# EAGLE design bb-7 (EAGLE 7.5.0)
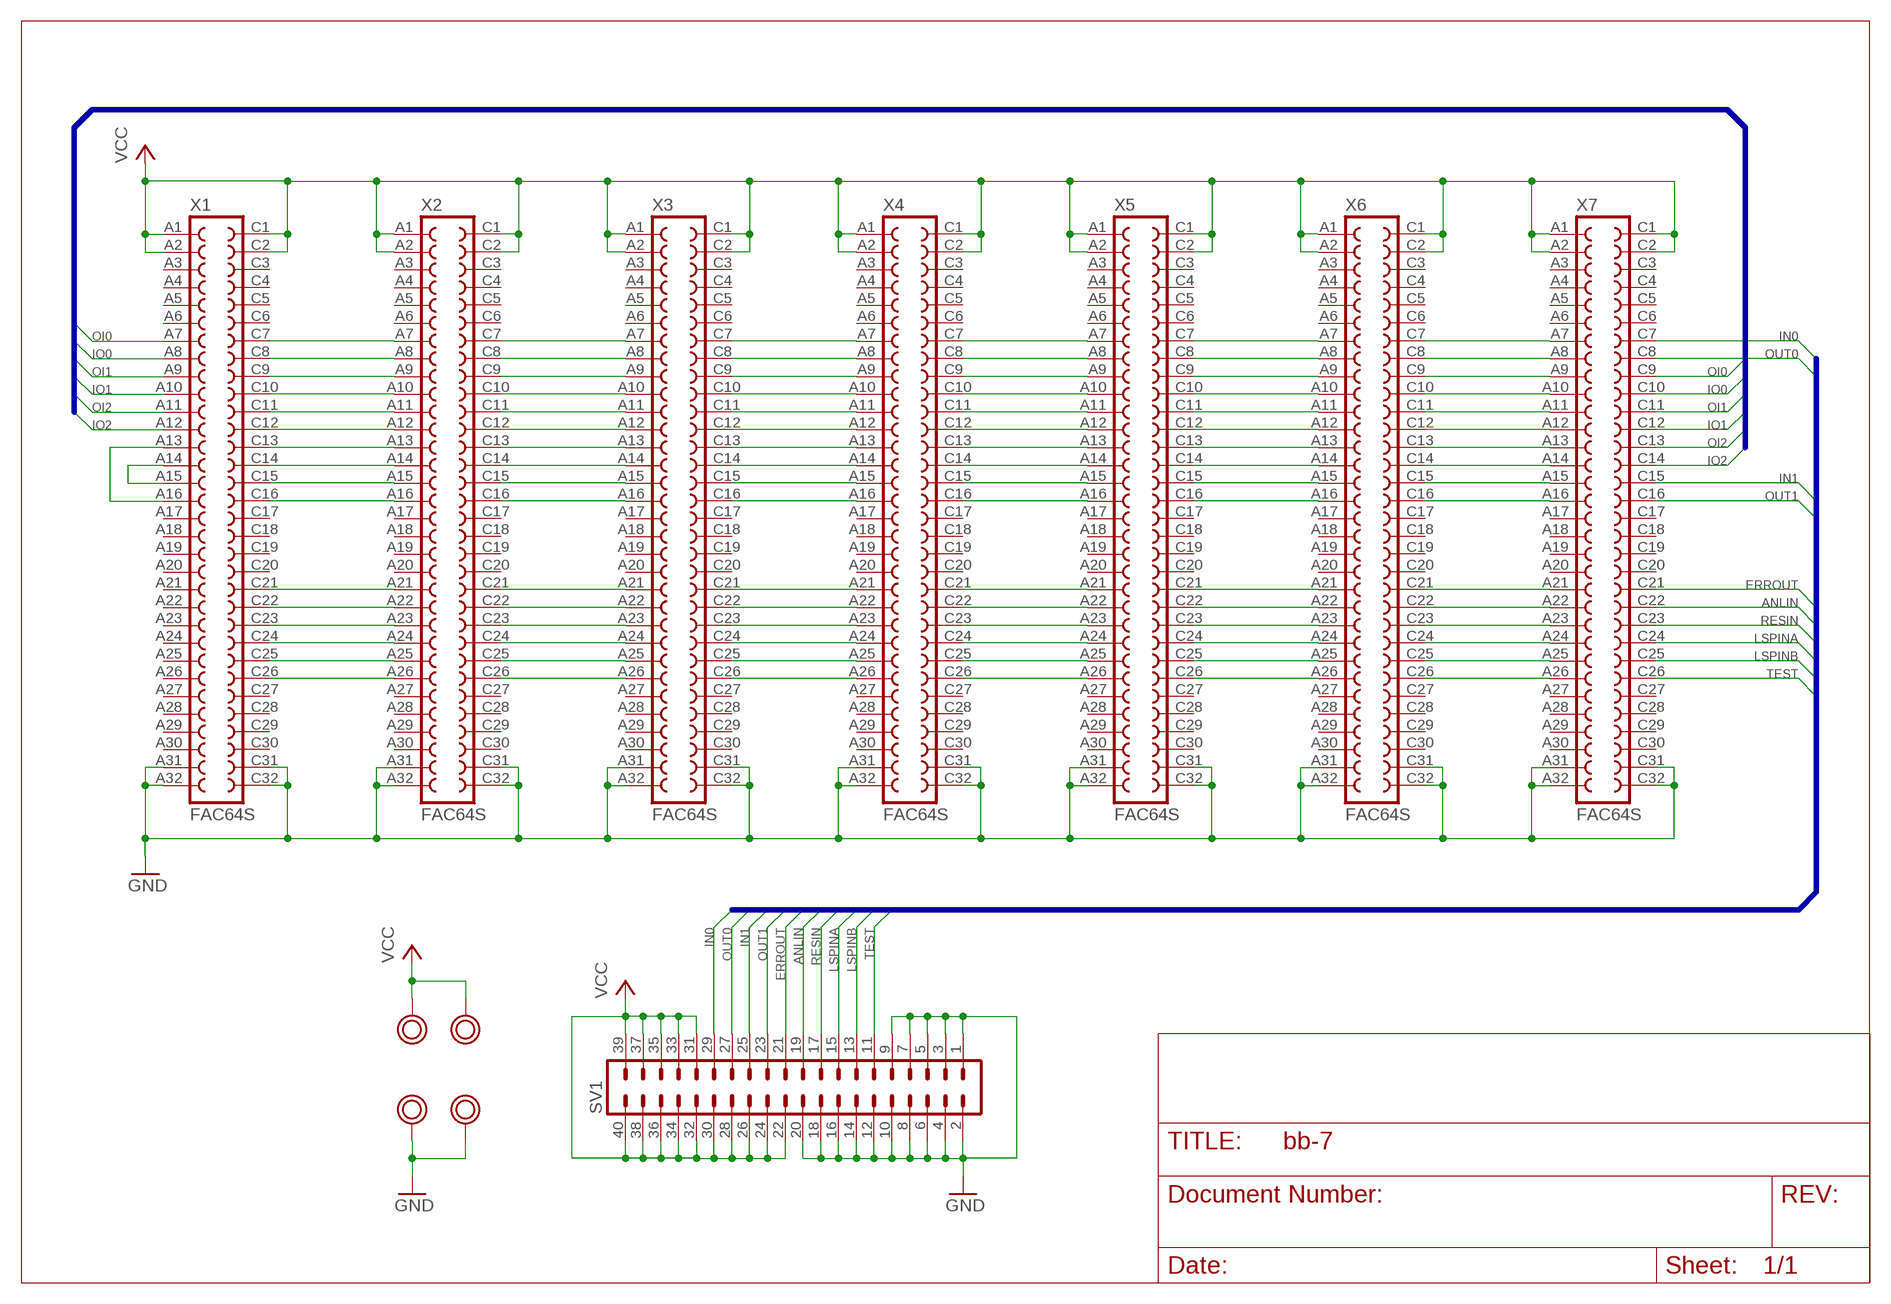
[diagram p0: schematic, sheet 1]

## Parts
SV1  MA20-2  [MA20-2]
U$3  POWERPAD  [POWERPAD]
U$4  POWERPAD  [POWERPAD]
U$5  POWERPAD  [POWERPAD]
U$6  POWERPAD  [POWERPAD]
X1  FAC64S  [FAC64S]
X2  FAC64S  [FAC64S]
X3  FAC64S  [FAC64S]
X4  FAC64S  [FAC64S]
X5  FAC64S  [FAC64S]
X6  FAC64S  [FAC64S]
X7  FAC64S  [FAC64S]

## Nets
ANLIN: SV1.19 X7.C22
ERROUT: SV1.21 X7.C21
GND: SV1.1 SV1.2 SV1.3 SV1.4 SV1.5 SV1.6 SV1.7 SV1.8 SV1.9 SV1.10 SV1.12 SV1.14 SV1.16 SV1.18 SV1.20 U$3.P$1 U$4.P$1 X1.A31 X1.A32 X1.C31 X1.C32 X2.A31 X2.A32 X2.C31 X2.C32 X3.A31 X3.A32 X3.C31 X3.C32 X4.A31 X4.A32 X4.C31 X4.C32 X5.A31 X5.A32 X5.C31 X5.C32 X6.A31 X6.A32 X6.C31 X6.C32 X7.A31 X7.A32 X7.C31 X7.C32
IN0: SV1.29 X7.C7
IN1: SV1.25 X7.C15
IO0: X1.A8 X7.C10
IO1: X1.A10 X7.C12
IO2: X1.A12 X7.C14
LSPINA: SV1.15 X7.C24
LSPINB: SV1.13 X7.C25
N$1: X1.A13 X1.A16
N$2: X1.A14 X1.A15
N$3: X4.C7 X5.A7
N$4: X2.C7 X3.A7
N$5: X2.C8 X3.A8
N$6: X2.C9 X3.A9
N$7: X1.C7 X2.A7
N$8: X1.C8 X2.A8
N$9: X1.C9 X2.A9
N$10: X1.C10 X2.A10
N$11: X1.C11 X2.A11
N$12: X1.C12 X2.A12
N$13: X1.C13 X2.A13
N$14: X1.C14 X2.A14
N$15: X1.C15 X2.A15
N$16: X1.C16 X2.A16
N$17: X2.C10 X3.A10
N$18: X2.C11 X3.A11
N$19: X2.C12 X3.A12
N$20: X2.C13 X3.A13
N$21: X1.C21 X2.A21
N$22: X1.C22 X2.A22
N$23: X1.C23 X2.A23
N$24: X1.C24 X2.A24
N$25: X1.C25 X2.A25
N$26: X1.C26 X2.A26
N$27: X2.C14 X3.A14
N$28: X2.C15 X3.A15
N$29: X2.C16 X3.A16
N$30: X2.C21 X3.A21
N$32: X2.C22 X3.A22
N$33: X2.C23 X3.A23
N$34: X2.C24 X3.A24
N$35: X2.C25 X3.A25
N$36: X2.C26 X3.A26
N$37: X4.C8 X5.A8
N$38: X4.C9 X5.A9
N$39: X3.C7 X4.A7
N$40: X3.C8 X4.A8
N$41: X3.C9 X4.A9
N$42: X3.C10 X4.A10
N$43: X3.C11 X4.A11
N$44: X3.C12 X4.A12
N$45: X3.C13 X4.A13
N$46: X3.C14 X4.A14
N$47: X3.C15 X4.A15
N$48: X3.C16 X4.A16
N$49: X3.C21 X4.A21
N$50: X3.C22 X4.A22
N$51: X3.C23 X4.A23
N$52: X3.C24 X4.A24
N$53: X3.C25 X4.A25
N$54: X3.C26 X4.A26
N$55: X4.C10 X5.A10
N$56: X4.C11 X5.A11
N$57: X4.C12 X5.A12
N$58: X4.C13 X5.A13
N$59: X4.C14 X5.A14
N$60: X4.C15 X5.A15
N$61: X4.C16 X5.A16
N$62: X4.C21 X5.A21
N$63: X4.C22 X5.A22
N$64: X4.C23 X5.A23
N$65: X4.C24 X5.A24
N$66: X4.C25 X5.A25
N$67: X4.C26 X5.A26
N$69: X5.C7 X6.A7
N$70: X5.C8 X6.A8
N$71: X5.C9 X6.A9
N$72: X5.C10 X6.A10
N$73: X5.C11 X6.A11
N$74: X5.C12 X6.A12
N$75: X5.C13 X6.A13
N$76: X5.C14 X6.A14
N$77: X5.C15 X6.A15
N$78: X5.C16 X6.A16
N$79: X5.C21 X6.A21
N$80: X5.C22 X6.A22
N$81: X5.C23 X6.A23
N$82: X5.C24 X6.A24
N$83: X5.C25 X6.A25
N$84: X5.C26 X6.A26
N$85: X6.C7 X7.A7
N$86: X6.C8 X7.A8
N$87: X6.C9 X7.A9
N$88: X6.C10 X7.A10
N$89: X6.C11 X7.A11
N$90: X6.C12 X7.A12
N$91: X6.C13 X7.A13
N$92: X6.C14 X7.A14
N$93: X6.C15 X7.A15
N$94: X6.C16 X7.A16
N$95: X6.C21 X7.A21
N$96: X6.C22 X7.A22
N$97: X6.C23 X7.A23
N$98: X6.C24 X7.A24
N$99: X6.C25 X7.A25
N$100: X6.C26 X7.A26
OI0: X1.A7 X7.C9
OI1: X1.A9 X7.C11
OI2: X1.A11 X7.C13
OUT0: SV1.27 X7.C8
OUT1: SV1.23 X7.C16
RESIN: SV1.17 X7.C23
TEST: SV1.11 X7.C26
VCC: SV1.22 SV1.24 SV1.26 SV1.28 SV1.30 SV1.31 SV1.32 SV1.33 SV1.34 SV1.35 SV1.36 SV1.37 SV1.38 SV1.39 SV1.40 U$5.P$1 U$6.P$1 X1.A1 X1.A2 X1.C1 X1.C2 X2.A1 X2.A2 X2.C1 X2.C2 X3.A1 X3.A2 X3.C1 X3.C2 X4.A1 X4.A2 X4.C1 X4.C2 X5.A1 X5.A2 X5.C1 X5.C2 X6.A1 X6.A2 X6.C1 X6.C2 X7.A1 X7.A2 X7.C1 X7.C2
Unconnected: X1.A3 X1.A4 X1.A5 X1.A6 X1.A17 X1.A18 X1.A19 X1.A20 X1.A21 X1.A22 X1.A23 X1.A24 X1.A25 X1.A26 X1.A27 X1.A28 X1.A29 X1.A30 X1.C3 X1.C4 X1.C5 X1.C6 X1.C17 X1.C18 X1.C19 X1.C20 X1.C27 X1.C28 X1.C29 X1.C30 X2.A3 X2.A4 X2.A5 X2.A6 X2.A17 X2.A18 X2.A19 X2.A20 X2.A27 X2.A28 X2.A29 X2.A30 X2.C3 X2.C4 X2.C5 X2.C6 X2.C17 X2.C18 X2.C19 X2.C20 X2.C27 X2.C28 X2.C29 X2.C30 X3.A3 X3.A4 X3.A5 X3.A6 X3.A17 X3.A18 X3.A19 X3.A20 X3.A27 X3.A28 X3.A29 X3.A30 X3.C3 X3.C4 X3.C5 X3.C6 X3.C17 X3.C18 X3.C19 X3.C20 X3.C27 X3.C28 X3.C29 X3.C30 X4.A3 X4.A4 X4.A5 X4.A6 X4.A17 X4.A18 X4.A19 X4.A20 X4.A27 X4.A28 X4.A29 X4.A30 X4.C3 X4.C4 X4.C5 X4.C6 X4.C17 X4.C18 X4.C19 X4.C20 X4.C27 X4.C28 X4.C29 X4.C30 X5.A3 X5.A4 X5.A5 X5.A6 X5.A17 X5.A18 X5.A19 X5.A20 X5.A27 X5.A28 X5.A29 X5.A30 X5.C3 X5.C4 X5.C5 X5.C6 X5.C17 X5.C18 X5.C19 X5.C20 X5.C27 X5.C28 X5.C29 X5.C30 X6.A3 X6.A4 X6.A5 X6.A6 X6.A17 X6.A18 X6.A19 X6.A20 X6.A27 X6.A28 X6.A29 X6.A30 X6.C3 X6.C4 X6.C5 X6.C6 X6.C17 X6.C18 X6.C19 X6.C20 X6.C27 X6.C28 X6.C29 X6.C30 X7.A3 X7.A4 X7.A5 X7.A6 X7.A17 X7.A18 X7.A19 X7.A20 X7.A27 X7.A28 X7.A29 X7.A30 X7.C3 X7.C4 X7.C5 X7.C6 X7.C17 X7.C18 X7.C19 X7.C20 X7.C27 X7.C28 X7.C29 X7.C30

## Buses
IN[0..1],OUT[0..1],ERRIN,ERROUT,ANLIN,RESIN,LSPINA,LSPINB,TEST
IO[0..2],OI[0..2]

## Library data of the parts
SV1 = con-lstb:MA20-2: PIN HEADER; OC_FARNELL: unknown; OC_NEWARK: unknown
U$3-U$6 = Transputer:POWERPAD
X1-X7 = con-vg:FAC64S: CONNECTOR female, 64 pins, block, type C, rows AC, grid 5.08 mm

## Board
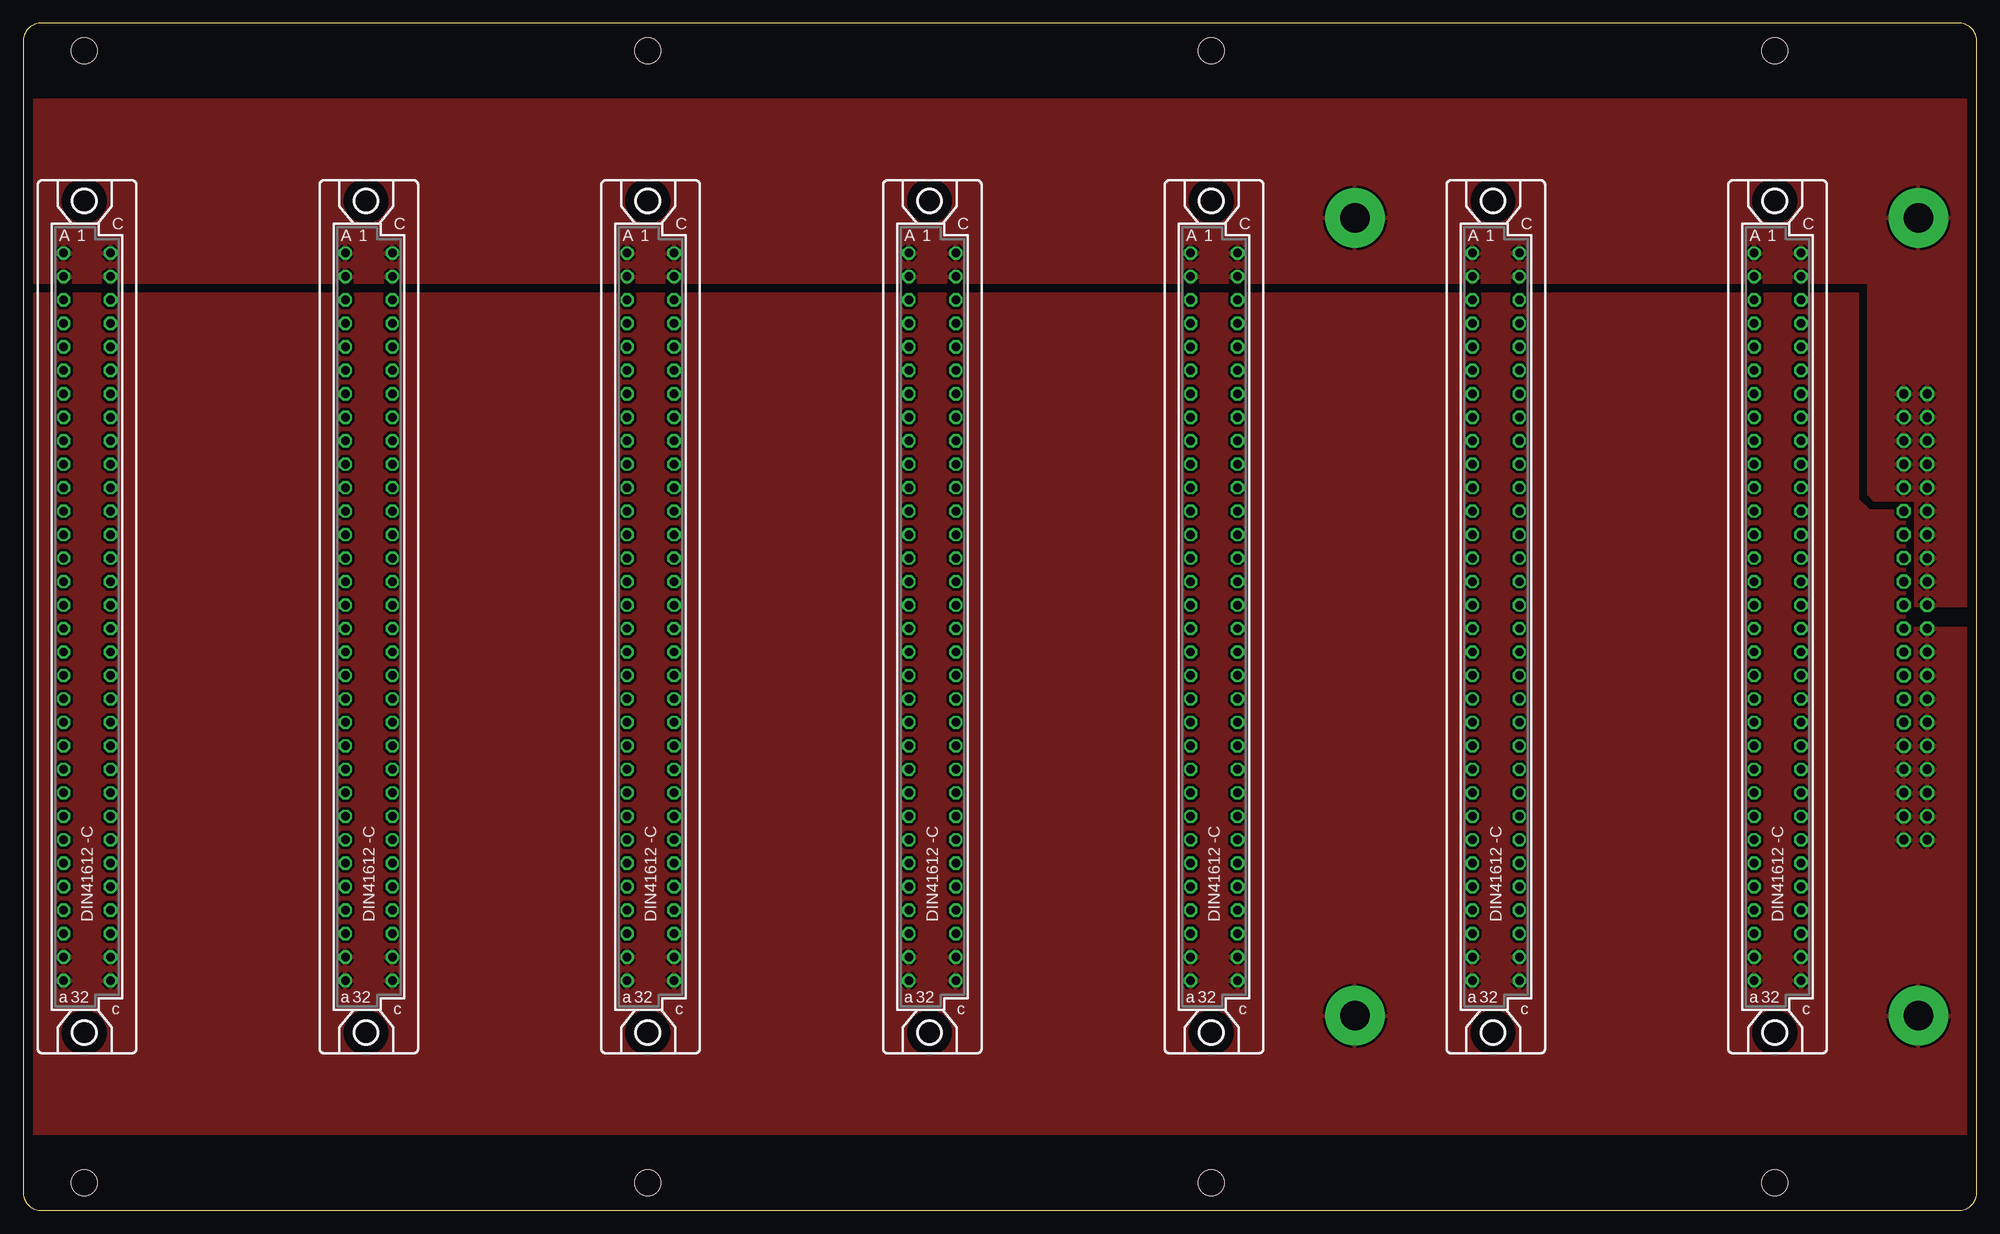
[diagram p1: board, top side]
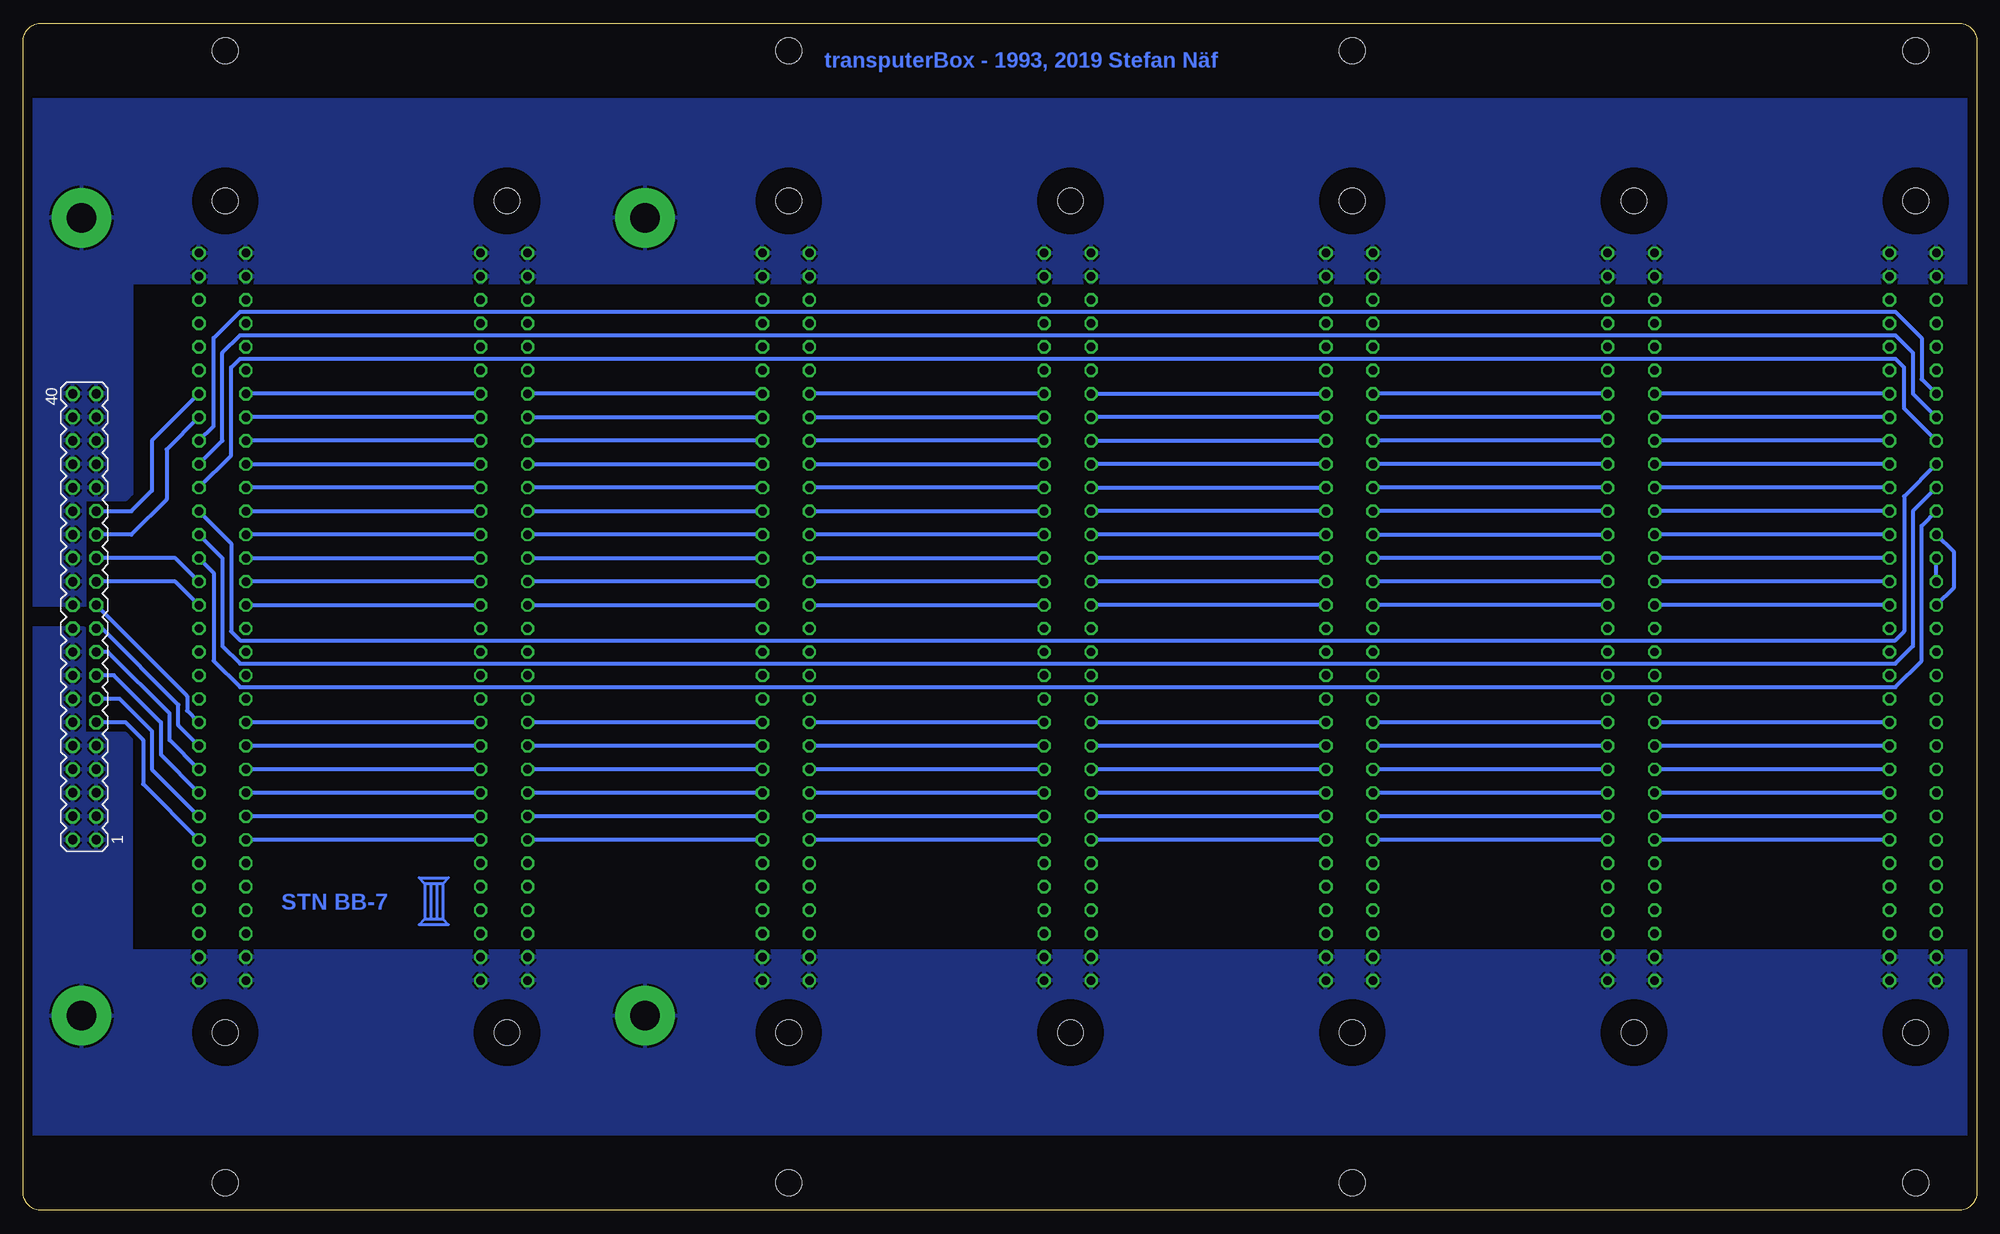
[diagram p2: board, bottom side, seen from below]

Size 211.36 x 128.5 mm. Coordinates in mm from the lower left corner, seen from the top.
Outline: 0,126.5 0,2 arc90 2,0 209.36,0 arc90 211.36,2 211.36,126.5 arc90 209.36,128.5 2,128.5 arc90 0,126.5
Copper layers (1*16): Top 0.035mm / dielectric 1.5mm / Bottom 0.035mm
Design rules "default": minimum track width 10mil, minimum drill 24mil, track to track 8mil, track to pad 8mil, pad to pad 8mil, via to via 8mil, smd to smd 8mil, copper to edge 40mil, drill to drill 8mil, minimum pad ring 10mil, minimum via ring 8mil, stop-mask expansion 4mil, vias tented up to drill 0mil, thermal gap 10mil
Holes 2.8 mm at 6.62,3 67.58,3 128.54,3 189.5,3 189.5,125.5 128.54,125.5 67.58,125.5 6.62,125.5

### Footprints (pad centres in the part's own frame; a part is rotated, then mirrored left to right if it is on the bottom)
MA20-2 = drill 1.016 octagon: 1 -24.13,-1.27; 2 -24.13,1.27; 3 -21.59,-1.27; 4 -21.59,1.27; 5 -19.05,-1.27; 6 -19.05,1.27; 7 -16.51,-1.27; 8 -16.51,1.27; 9 -13.97,-1.27; 10 -13.97,1.27; 11 -11.43,-1.27; 12 -11.43,1.27; 13 -8.89,-1.27; 14 -8.89,1.27; 15 -6.35,-1.27; 16 -6.35,1.27; 17 -3.81,-1.27; 18 -3.81,1.27; 19 -1.27,-1.27; 20 -1.27,1.27; 21 1.27,-1.27; 22 1.27,1.27; 23 3.81,-1.27; 24 3.81,1.27; 25 6.35,-1.27; 26 6.35,1.27; 27 8.89,-1.27; 28 8.89,1.27; 29 11.43,-1.27; 30 11.43,1.27; 31 13.97,-1.27; 32 13.97,1.27; 33 16.51,-1.27; 34 16.51,1.27; 35 19.05,-1.27; 36 19.05,1.27; 37 21.59,-1.27; 38 21.59,1.27; 39 24.13,-1.27; 40 24.13,1.27
POWERPAD = drill 3.2 pad 6.452: P$1 0,0
FAC64S = drill 0.914 octagon: A1 -2.54,39.37; A2 -2.54,36.83; A3 -2.54,34.29; A4 -2.54,31.75; A5 -2.54,29.21; A6 -2.54,26.67; A7 -2.54,24.13; A8 -2.54,21.59; A9 -2.54,19.05; A10 -2.54,16.51; A11 -2.54,13.97; A12 -2.54,11.43; A13 -2.54,8.89; A14 -2.54,6.35; A15 -2.54,3.81; A16 -2.54,1.27; A17 -2.54,-1.27; A18 -2.54,-3.81; A19 -2.54,-6.35; A20 -2.54,-8.89; A21 -2.54,-11.43; A22 -2.54,-13.97; A23 -2.54,-16.51; A24 -2.54,-19.05; A25 -2.54,-21.59; A26 -2.54,-24.13; A27 -2.54,-26.67; A28 -2.54,-29.21; A29 -2.54,-31.75; A30 -2.54,-34.29; A31 -2.54,-36.83; A32 -2.54,-39.37; C1 2.54,39.37; C2 2.54,36.83; C3 2.54,34.29; C4 2.54,31.75; C5 2.54,29.21; C6 2.54,26.67; C7 2.54,24.13; C8 2.54,21.59; C9 2.54,19.05; C10 2.54,16.51; C11 2.54,13.97; C12 2.54,11.43; C13 2.54,8.89; C14 2.54,6.35; C15 2.54,3.81; C16 2.54,1.27; C17 2.54,-1.27; C18 2.54,-3.81; C19 2.54,-6.35; C20 2.54,-8.89; C21 2.54,-11.43; C22 2.54,-13.97; C23 2.54,-16.51; C24 2.54,-19.05; C25 2.54,-21.59; C26 2.54,-24.13; C27 2.54,-26.67; C28 2.54,-29.21; C29 2.54,-31.75; C30 2.54,-34.29; C31 2.54,-36.83; C32 2.54,-39.37 | hole 2.794: -0.305,45.009; -0.305,-45.009

### Placement (x,y rotation side)
SV1  204.72,64.25 90 bottom
U$1  [LOGO]  166.94,33.45 0 bottom
U$3  205.04,21.07 0 top
U$4  144.08,21.07 0 top
U$5  205.04,107.43 0 top
U$6  144.08,107.43 0 top
X1  6.92,64.25 0 top
X2  37.4,64.25 0 top
X3  67.88,64.25 0 top
X4  98.36,64.25 0 top
X5  128.84,64.25 0 top
X6  159.32,64.25 0 top
X7  189.8,64.25 0 top

### Tracks (layer width: path | path; a pad name or v marks a point on that pad's centre or on a via)
ANLIN
  Bottom 0.406: X7.C22 194.56,52.5 194.56,54.73 202.82,62.98 SV1.19
ERROUT
  Bottom 0.406: X7.C21 193.61,54.09 193.61,55.68 SV1.21
GND
  pour Top (isolate 0.305): -0.07,99.17 198.37,99.17 198.37,76.95 199.64,75.68 203.45,75.68 203.45,62.98 211.07,62.98 211.07,62.66 211.39,8.37 -0.07,8.37
  pour Bottom (isolate 0.406): -0.07,8.37 -0.07,28.05 211.39,28.05 211.39,8.37
  pour Bottom: 211.39,28.05 199.64,28.05 199.64,50.91 200.28,51.55 204.72,51.55 204.72,62.98 211.39,62.98
IN0
  Bottom 0.406: X7.C7 197.42,83.3 197.42,77.9 199.64,75.68 SV1.29
IN1
  Bottom 0.406: X7.C15 194.88,70.6 SV1.25
IO0
  Bottom 0.406: X7.C10 189.8,83.3 189.8,92.83 187.89,94.73 8.82,94.73 6.92,92.83 6.92,88.38 X1.A8
IO1
  Bottom 0.406: X7.C12 188.85,72.19 188.85,62.66 187.89,61.71 8.82,61.71 7.87,62.66 7.87,77.27 X1.A10
IO2
  Bottom 0.406: X7.C14 190.75,69.01 190.75,59.49 187.89,56.63 8.82,56.63 5.97,59.49 5.97,74.09 X1.A12
LSPINA
  Bottom 0.406: X7.C24 196.47,49.33 196.47,52.82 201.55,57.9 SV1.15
LSPINB
  Bottom 0.406: X7.C25 197.42,47.74 197.42,51.87 200.91,55.36 SV1.13
N$1
  Bottom 0.406: X1.A16 2.47,67.42 2.47,71.23 X1.A13
N$2
  Bottom 0.406: X1.A15 X1.A14
N$3
  Bottom 0.406: X4.C7 X5.A7
N$4
  Bottom 0.406: X2.C7 X3.A7
N$5
  Bottom 0.406: X2.C8 X3.A8
N$6
  Bottom 0.406: X2.C9 X3.A9
N$7
  Bottom 0.406: X1.C7 X2.A7
N$8
  Bottom 0.406: X1.C8 X2.A8
N$9
  Bottom 0.406: X1.C9 X2.A9
N$10
  Bottom 0.406: X1.C10 X2.A10
N$11
  Bottom 0.406: X1.C11 X2.A11
N$12
  Bottom 0.406: X1.C12 X2.A12
N$13
  Bottom 0.406: X1.C13 X2.A13
N$14
  Bottom 0.406: X1.C14 X2.A14
N$15
  Bottom 0.406: X1.C15 X2.A15
N$16
  Bottom 0.406: X1.C16 X2.A16
N$17
  Bottom 0.406: X2.C10 X3.A10
N$18
  Bottom 0.406: X2.C11 X3.A11
N$19
  Bottom 0.406: X2.C12 X3.A12
N$20
  Bottom 0.406: X3.A13 X2.C13
N$21
  Bottom 0.406: X1.C21 X2.A21
N$22
  Bottom 0.406: X1.C22 X2.A22
N$23
  Bottom 0.406: X1.C23 X2.A23
N$24
  Bottom 0.406: X1.C24 X2.A24
N$25
  Bottom 0.406: X1.C25 X2.A25
N$26
  Bottom 0.406: X1.C26 X2.A26
N$27
  Bottom 0.406: X2.C14 X3.A14
N$28
  Bottom 0.406: X2.C15 X3.A15
N$29
  Bottom 0.406: X2.C16 X3.A16
N$30
  Bottom 0.406: X2.C21 X3.A21
N$32
  Bottom 0.406: X2.C22 X3.A22
N$33
  Bottom 0.406: X2.C23 X3.A23
N$34
  Bottom 0.406: X2.C24 X3.A24
N$35
  Bottom 0.406: X2.C25 X3.A25
N$36
  Bottom 0.406: X2.C26 X3.A26
N$37
  Bottom 0.406: X5.A8 X4.C8
N$38
  Bottom 0.406: X4.C9 X5.A9
N$39
  Bottom 0.406: X4.A7 X3.C7
N$40
  Bottom 0.406: X3.C8 X4.A8
N$41
  Bottom 0.406: X4.A9 X3.C9
N$42
  Bottom 0.406: X3.C10 X4.A10
N$43
  Bottom 0.406: X4.A11 X3.C11
N$44
  Bottom 0.406: X3.C12 X4.A12
N$45
  Bottom 0.406: X3.C13 X4.A13
N$46
  Bottom 0.406: X3.C14 X4.A14
N$47
  Bottom 0.406: X3.C15 X4.A15
N$48
  Bottom 0.406: X3.C16 X4.A16
N$49
  Bottom 0.406: X3.C21 X4.A21
N$50
  Bottom 0.406: X3.C22 X4.A22
N$51
  Bottom 0.406: X3.C23 X4.A23
N$52
  Bottom 0.406: X3.C24 X4.A24
N$53
  Bottom 0.406: X3.C25 X4.A25
N$54
  Bottom 0.406: X3.C26 X4.A26
N$55
  Bottom 0.406: X5.A10 X4.C10
N$56
  Bottom 0.406: X4.C11 X5.A11
N$57
  Bottom 0.406: X5.A12 X4.C12
N$58
  Bottom 0.406: X4.C13 X5.A13
N$59
  Bottom 0.406: X5.A14 X4.C14
N$60
  Bottom 0.406: X4.C15 X5.A15
N$61
  Bottom 0.406: X5.A16 X4.C16
N$62
  Bottom 0.406: X4.C21 X5.A21
N$63
  Bottom 0.406: X4.C22 X5.A22
N$64
  Bottom 0.406: X4.C23 X5.A23
N$65
  Bottom 0.406: X4.C24 X5.A24
N$66
  Bottom 0.406: X4.C25 X5.A25
N$67
  Bottom 0.406: X4.C26 X5.A26
N$69
  Bottom 0.406: X5.C7 X6.A7
N$70
  Bottom 0.406: X6.A8 X5.C8
N$71
  Bottom 0.406: X5.C9 X6.A9
N$72
  Bottom 0.406: X6.A10 X5.C10
N$73
  Bottom 0.406: X5.C11 X6.A11
N$74
  Bottom 0.406: X6.A12 X5.C12
N$75
  Bottom 0.406: X5.C13 X6.A13
N$76
  Bottom 0.406: X6.A14 X5.C14
N$77
  Bottom 0.406: X5.C15 X6.A15
N$78
  Bottom 0.406: X6.A16 X5.C16
N$79
  Bottom 0.406: X5.C21 X6.A21
N$80
  Bottom 0.406: X5.C22 X6.A22
N$81
  Bottom 0.406: X5.C23 X6.A23
N$82
  Bottom 0.406: X5.C24 X6.A24
N$83
  Bottom 0.406: X5.C25 X6.A25
N$84
  Bottom 0.406: X5.C26 X6.A26
N$85
  Bottom 0.406: X6.C7 X7.A7
N$86
  Bottom 0.406: X6.C8 X7.A8
N$87
  Bottom 0.406: X6.C9 X7.A9
N$88
  Bottom 0.406: X7.A10 X6.C10
N$89
  Bottom 0.406: X6.C11 X7.A11
N$90
  Bottom 0.406: X7.A12 X6.C12
N$91
  Bottom 0.406: X6.C13 X7.A13
N$92
  Bottom 0.406: X7.A14 X6.C14
N$93
  Bottom 0.406: X6.C15 X7.A15
N$94
  Bottom 0.406: X7.A16 X6.C16
N$95
  Bottom 0.406: X6.C21 X7.A21
N$96
  Bottom 0.406: X6.C22 X7.A22
N$97
  Bottom 0.406: X6.C23 X7.A23
N$98
  Bottom 0.406: X6.C24 X7.A24
N$99
  Bottom 0.406: X6.C25 X7.A25
N$100
  Bottom 0.406: X6.C26 X7.A26
OI0
  Bottom 0.406: X7.C9 190.75,84.89 190.75,94.41 187.89,97.27 8.82,97.27 5.97,94.41 5.97,89.97 X1.A7
OI1
  Bottom 0.406: X7.C11 188.85,81.71 188.85,91.24 187.89,92.19 8.82,92.19 7.87,91.24 7.87,86.79 X1.A9
OI2
  Bottom 0.406: X7.C13 189.8,70.6 189.8,61.08 187.89,59.17 8.82,59.17 6.92,61.08 6.92,75.68 X1.A11
OUT0
  Bottom 0.406: X7.C8 195.83,82.35 195.83,76.95 199.64,73.14 SV1.27
OUT1
  Bottom 0.406: X7.C16 194.88,68.06 SV1.23
RESIN
  Bottom 0.406: X7.C23 195.51,50.91 195.51,53.77 202.18,60.44 SV1.17
TEST
  Bottom 0.406: X7.C26 198.37,46.15 198.37,50.91 200.28,52.82 SV1.11
VCC
  pour Top (isolate 0.406): -0.07,100.44 -0.07,120.13 211.39,120.13 211.39,100.44
  pour Bottom (isolate 0.406): -0.07,100.44 -0.07,120.13 211.39,120.13 211.39,100.44
  pour Top: 211.39,100.44 199.64,100.44 199.64,77.59 200.28,76.95 204.72,76.95 204.72,65.52 211.39,65.52
  pour Bottom: 211.39,100.44 199.64,100.44 199.64,77.59 200.28,76.95 204.72,76.95 204.72,65.52 211.39,65.52

### Text on the board
Bottom: transputerBox - 1993, 2019 Stefan Näf | STN BB-7